# Altium project originbot_controller.PrjPcb
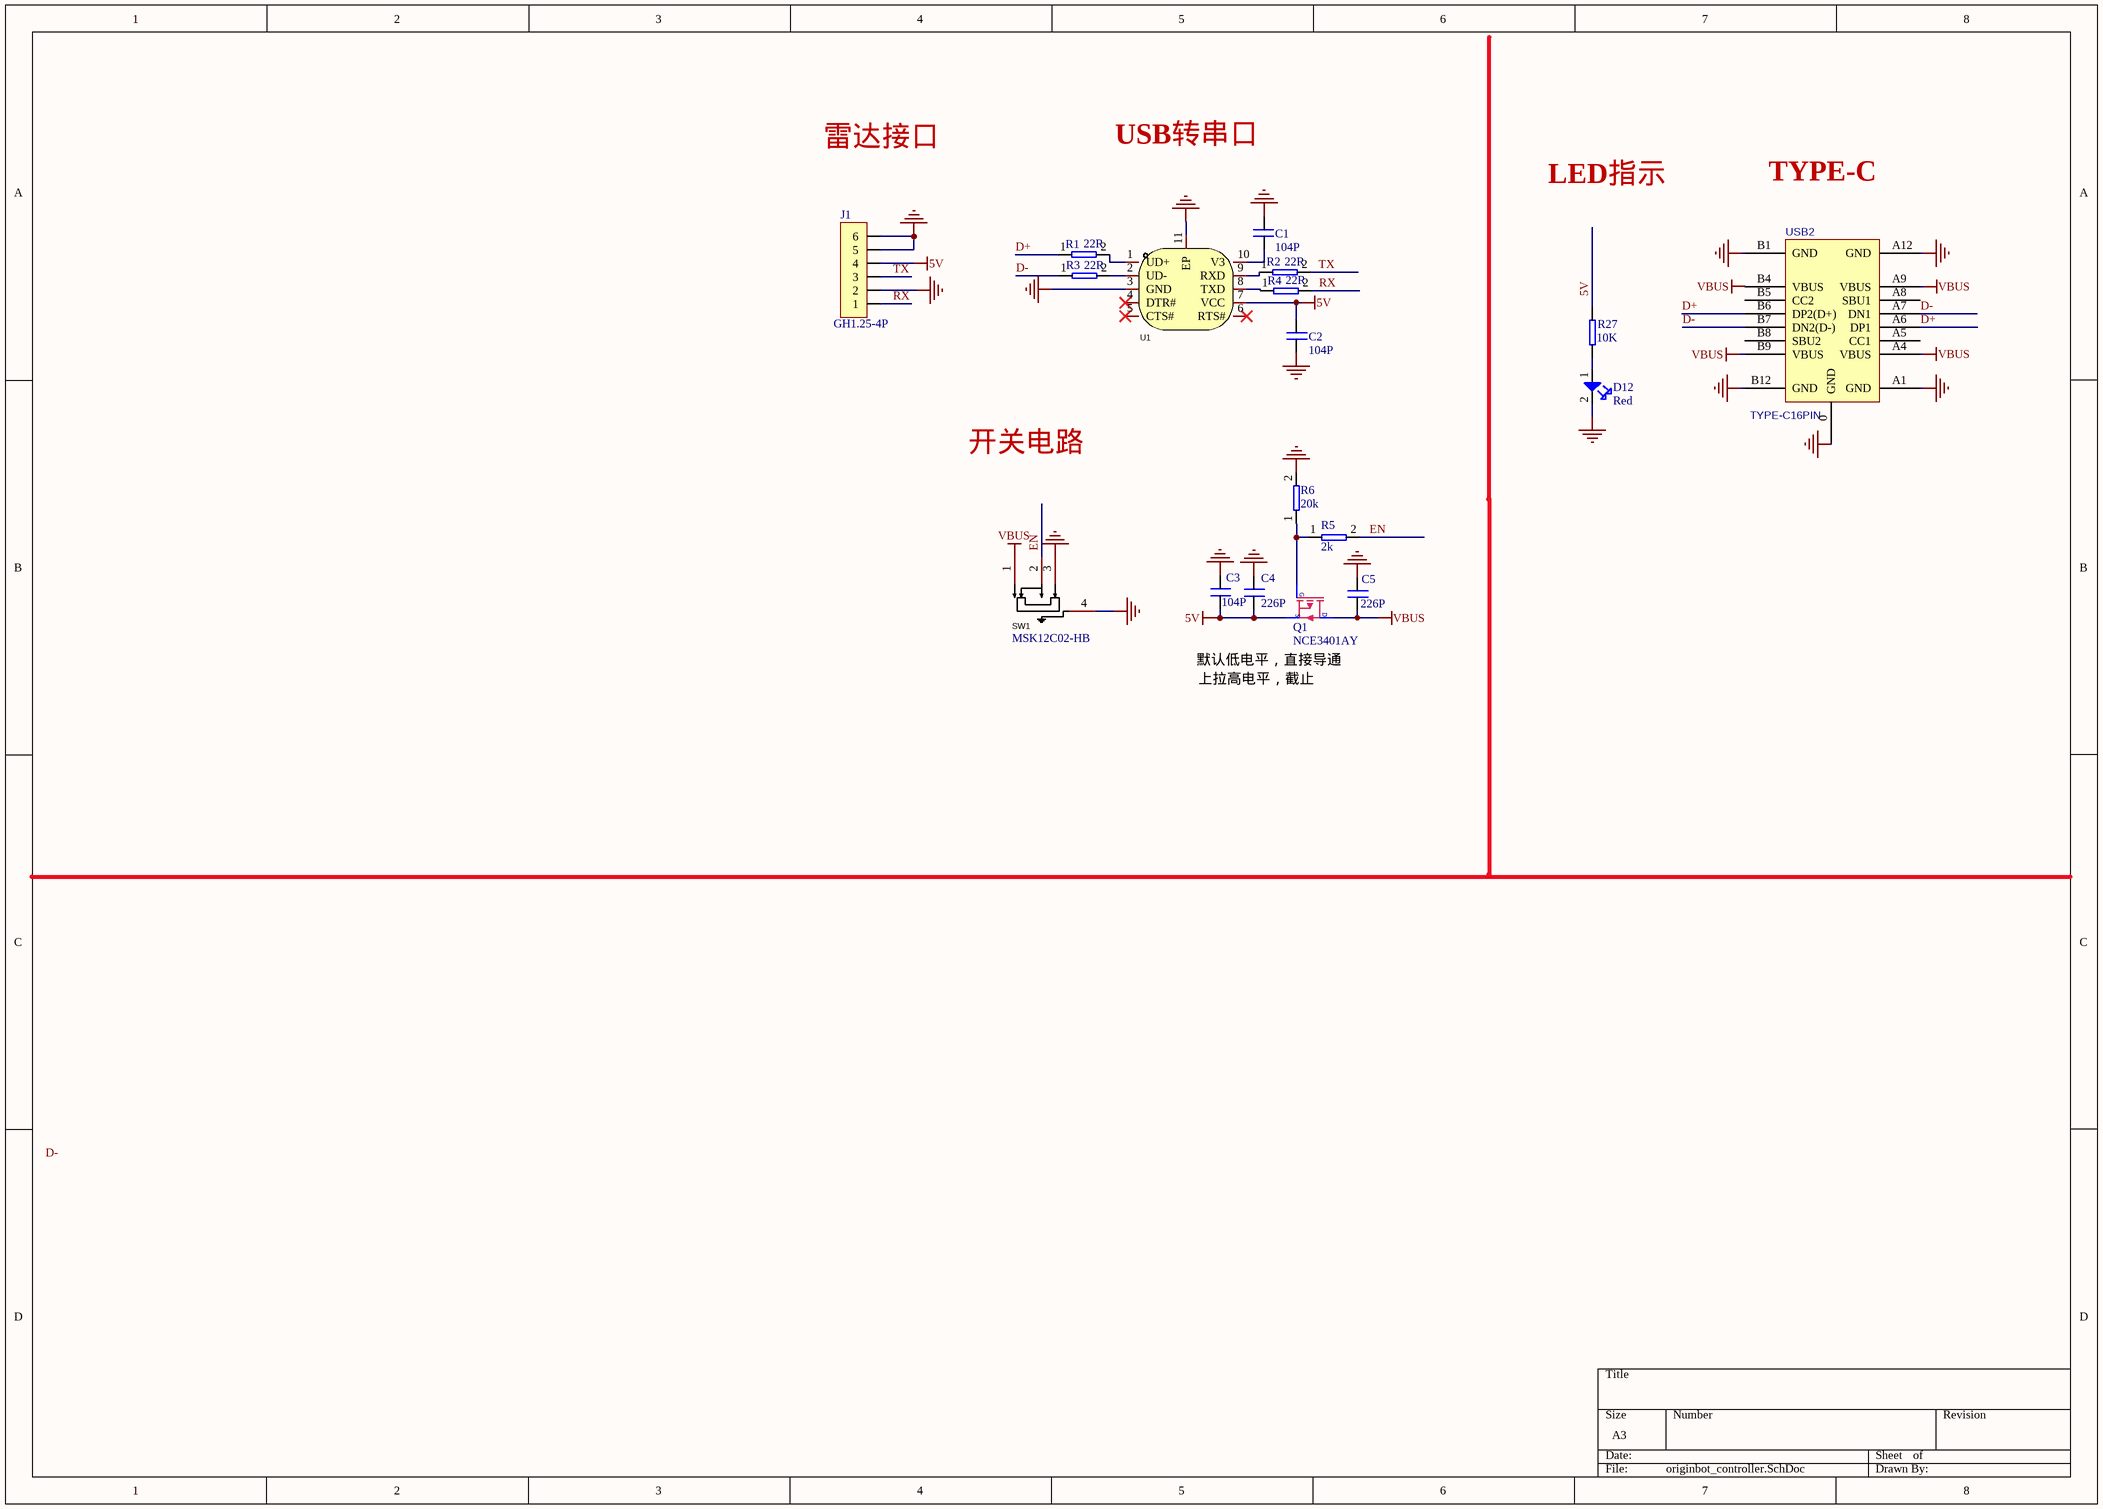
[diagram p0: originbot_controller.SchDoc]
1 sheet, 18 parts. Net scope: global (net labels, ports and power ports of the same name join across sheets).
Board file: originbot_controller.PcbDoc

## Sheet originbot_controller.SchDoc
size A3

### Parts
C1  104P  [C0603]
C2  104P  [C0603]
C3  104P  [C0603]
C4  226P  [C0603]
C5  226P  [C0603]
D12  Red  [D0603-R]
J1  GH1.25-4P  [GH1.25MM]
Q1  NCE3401AY  [SOT-23-3]
R1  22R  [R0603]
R2  22R  [R0603]
R3  22R  [R0603]
R4  22R  [R0603]
R5  2k  [R0603]
R6  20k  [R0603]
R27  10K  [R0603]
SW1  MSK12C02-HB  [MSK12C02-HB]
U1  CH340K  [ESOP10]  (value not drawn)
USB2  TYPE-C16PIN  [USB-C-SMD_TYPE-C16PIN]

### Nets
5V: C2.2 C3.1 C4.1 J1.4 Q1.2 R27.2 U1.7(VCC)
GND: C1.1 C2.1 C3.2 C4.2 C5.2 D12.2 J1.2 J1.5 J1.6 R6.2 SW1.3 SW1.4 U1.3(GND) U1.11(EP) USB2.0(GND) USB2.A1(GND) USB2.A12(GND) USB2.B1(GND) USB2.B12(GND)
VBUS: C5.1 Q1.3 SW1.1 USB2.A4(VBUS) USB2.A9(VBUS) USB2.B4(VBUS) USB2.B9(VBUS)
D+: R1.1 USB2.A6(DP1) USB2.B6(DP2(D+))
D-: R3.1 USB2.A7(DN1) USB2.B7(DN2(D-))
EN: R5.2 SW1.2
RX: J1.1 R4.2
TX: J1.3 R2.2
NetC1_2: C1.2 U1.10(V3)
NetD12_1: D12.1 R27.1
NetQ1_1: Q1.1 R5.1 R6.1
NetR1_2: R1.2 U1.1(UD+)
NetR2_1: R2.1 U1.9(RXD)
NetR3_2: R3.2 U1.2(UD-)
NetR4_1: R4.1 U1.8(TXD)

Not connected (* = marked no-connect by the designer): U1 4(DTR#)* 5(CTS#)* 6(RTS#)*; USB2 A5(CC1) A8(SBU1) B5(CC2) B8(SBU2)

### Notes on the sheet
- (near J1) 雷达接口
- USB转串口
- LED指示
- (near USB2) TYPE-C
- 开关电路
- 默认低电平，直接导通
- 上拉高电平，截止
- Labels drawn without touching a wire or pin: D-
- (in symbol PMOS) G; S; D

### Library data of the parts
C1-C5 = Cap
D12 = LED-贴片
J1 = Header6
Q1 = PMOS
R1-R6 = RN
R27 = Res
SW1 = MSK12C02-HB: Manufacturer: SHOU HAN(�׺�); Add into BOM: yes; Circuit: ����˫��; Pin Style: SMD��Ƭ; Switch Length: 8mm; Switch Width: 2.8mm; Switch Height: 1.4mm; Current Rating (DC): 50mA; Voltage Rating (DC): 12V; Mechanical Life: 1���; Symbol: MSK12C02-HB; Device: MSK12C02-HB; Supplier: LCSC; Supplier Part: C431541; Manufacturer Part: MSK12C02-HB; JLCPCB Part Class: Extended Part; LCSC Part Name: �����ದ��Ƭ 7�Ų��� �ڱ�,����1.5mm,����λ��; Supplier Footprint: SMD; Datasheet: https://atta.szlcsc.com/upload/public/pdf/source/20190925/C431541_43A76A06FD86AD8E3069A6BFECE3ABC5.pdf; Convert to PCB: yes; Actuator Style: -; Mounting Style: ����; Actuator Color: -; Current Rating (AC): -; Voltage Rating (AC): -; Operating Temperature: -20��~+70��
U1 = CH340K: Manufacturer: WCH(南京沁恒); Add into BOM: yes; Name: CH340K; Symbol: CH340K; Device: CH340K; LCSC Part Name: CH340K; Supplier Part: C968586; Manufacturer Part: CH340K; Supplier Footprint: ESOP-10-EP-150mil; JLCPCB Part Class: Extended Part; Datasheet: https://atta.szlcsc.com/upload/public/pdf/source/20200819/C84681_ADBED554CE321879DBD6B1D06488689C.pdf; Supplier: LCSC; Convert to PCB: yes; Applications Function: -; Protocol: -
USB2 = TYPE-C16PIN: BOM_Manufacturer: SHOU HAN; Contributor: LCSC; BOM_Supplier: LCSC; BOM_Supplier Part: C393939; BOM_Manufacturer Part: TYPE-C16PIN; spicePre: U; spiceSymbolName: TYPE-C16PIN